# Altium schematic sheet signal_conditioning.SchDoc
size A4
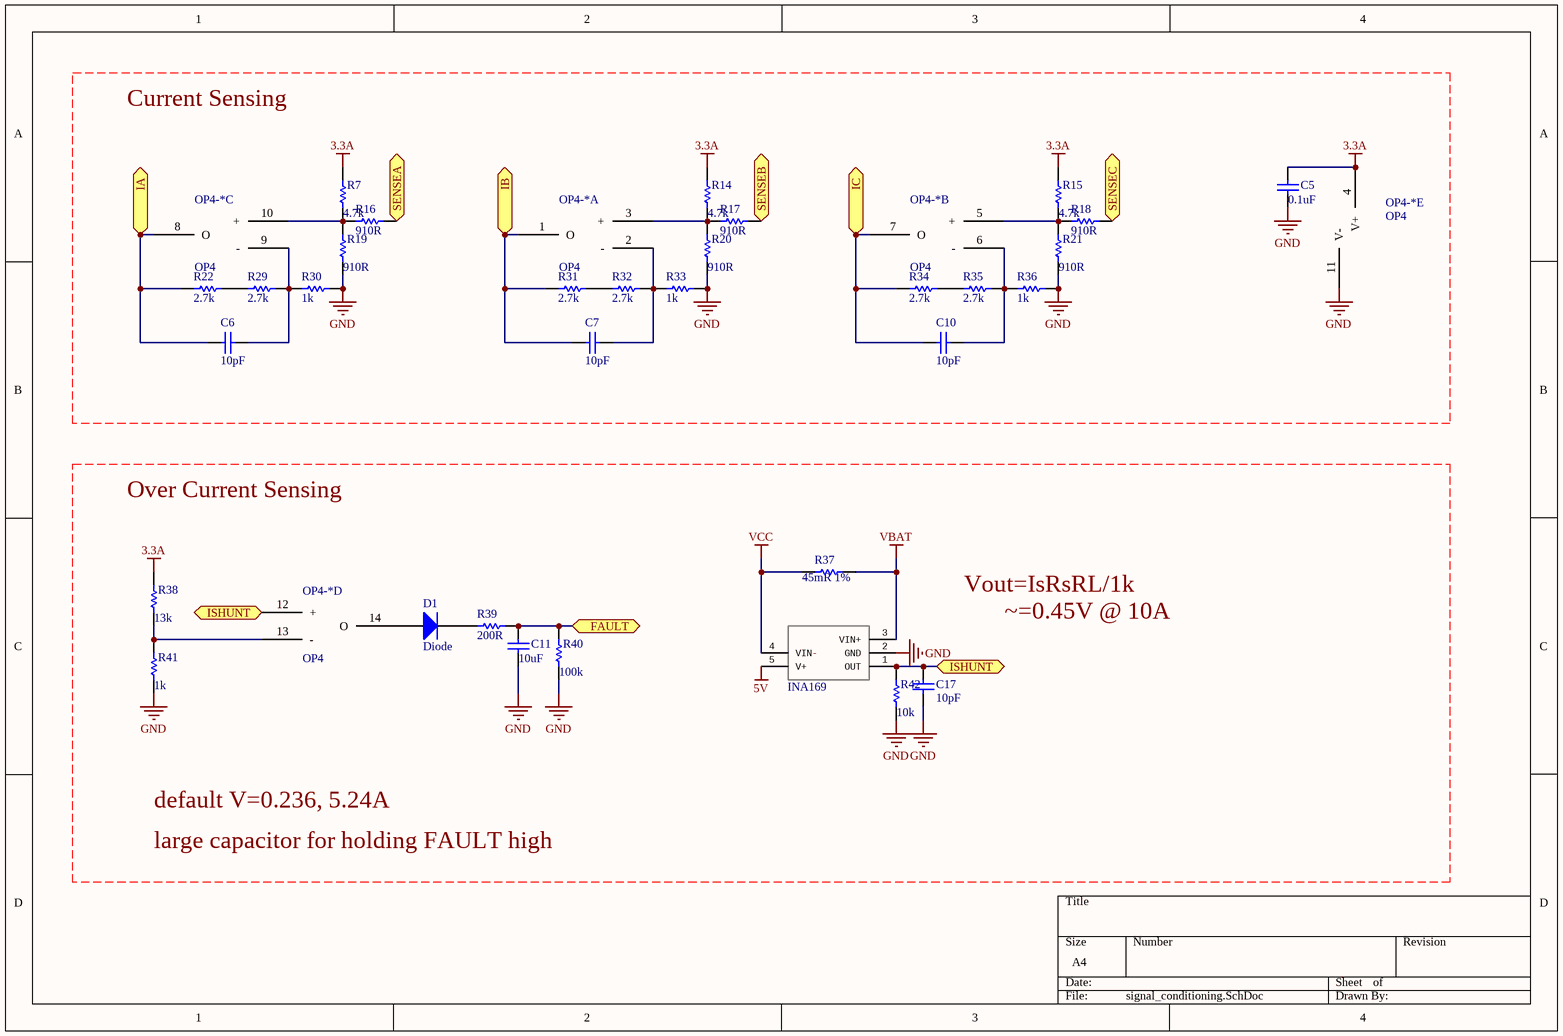
[diagram p0: signal_conditioning.SchDoc]

## Parts
C5  0.1uF  [0603]
C6  10pF  [0603]
C7  10pF  [0603]
C10  10pF  [0603]
C11  10uF  [0805]
C17  10pF  [0603]
D1  Diode  [0805]
OP4-*  OP4  [SOP14]  (parts A,B,C,D,E of 5)
R7  4.7k  [0603]
R14  4.7k  [0603]
R15  4.7k  [0603]
R16  910R  [0603]
R17  910R  [0603]
R18  910R  [0603]
R19  910R  [0603]
R20  910R  [0603]
R21  910R  [0603]
R22  2.7k  [0603]
R29  2.7k  [0603]
R30  1k  [0603]
R31  2.7k  [0603]
R32  2.7k  [0603]
R33  1k  [0603]
R34  2.7k  [0603]
R35  2.7k  [0603]
R36  1k  [0603]
R37  45mR 1%  [2512]
R38  13k  [0603]
R39  200R  [0603]
R40  100k  [0603]
R41  1k  [0603]
R42  10k  [0603]
U$1  INA169  [SOT23-5]

## Ports
FAULT, IA, IB, IC, ISHUNT, SENSEA, SENSEB, SENSEC

## Nets
3.3A: C5.1 OP4-*.4(V+) R7.2 R14.2 R15.2 R38.2
5V: U$1.5(V+)
GND: C5.2 C11.2 C17.1 OP4-*.11(V-) R19.1 R20.1 R21.1 R30.1 R33.1 R36.1 R40.1 R41.1 R42.1 U$1.2(GND)
VBAT: R37.2 U$1.3(VIN+)
VCC: R37.1 U$1.4(VIN-)
FAULT: C11.1 R39.1 R40.2 ; port FAULT
IA: C6.1 OP4-*.8(O) R22.2 ; port IA
IB: C7.1 OP4-*.1(O) R31.2 ; port IB
IC: C10.1 OP4-*.7(O) R34.2 ; port IC
ISHUNT: C17.2 OP4-*.12(+) R42.2 U$1.1(OUT) ; port ISHUNT
SENSEA: R16.1 ; port SENSEA
SENSEB: R17.1 ; port SENSEB
SENSEC: R18.1 ; port SENSEC
NetC6_2: C6.2 OP4-*.9(-) R29.1 R30.2
NetC7_2: C7.2 OP4-*.2(-) R32.1 R33.2
NetC10_2: C10.2 OP4-*.6(-) R35.1 R36.2
NetD1_1: D1.1(A) OP4-*.14(O)
NetD1_2: D1.2(K) R39.2
NetOP4-*_3: OP4-*.3(+) R14.1 R17.2 R20.2
NetOP4-*_5: OP4-*.5(+) R15.1 R18.2 R21.2
NetOP4-*_10: OP4-*.10(+) R7.1 R16.2 R19.2
NetOP4-*_13: OP4-*.13(-) R38.1 R41.2
NetR22_1: R22.1 R29.2
NetR31_1: R31.1 R32.2
NetR34_1: R34.1 R35.2

## Notes on the sheet
- Current Sensing
- Over Current Sensing
- Vout=IsRsRL/1k
- ~=0.45V @ 10A
- default V=0.236, 5.24A
- large capacitor for holding FAULT high

## Library data of the parts
C5 = Cap: Capacitor; Published: 8-Jun-2000; LatestRevisionDate: 17-Jul-2002; LatestRevisionNote: Re-released for DXP Platform.; PackageReference: RAD-0.3; Publisher: Altium Limited; PackageDescription: Radial Cap, Thru-Hole; 2 Leads; 0.3 in Pin Spacing; Value: 0.1uf
C6 C7 C10 C11 C17 = Cap: Capacitor; Value: 0.1uf; Published: 8-Jun-2000; LatestRevisionDate: 17-Jul-2002; LatestRevisionNote: Re-released for DXP Platform.; PackageReference: RAD-0.3; Publisher: Altium Limited; PackageDescription: Radial Cap, Thru-Hole; 2 Leads; 0.3 in Pin Spacing
D1 = Diode: Default Diode; Published: 8-Jun-2000; LatestRevisionDate: 17-Jul-2002; LatestRevisionNote: Re-released for DXP Platform.; PackageVersion: Sep-1996; PackageReference: SMC; Publisher: Altium Limited; PackageDescription: DO-214-AB/SMC; 2 C-Bend Leads; Body 7.9 x 5.9 mm, inc. leads (LxW); Code_JEDEC: DO-214-AB
R7 R14-R22 R29-R41 = Res1: Resistor; Value: 10K; Published: 8-Jun-2000; LatestRevisionDate: 17-Jul-2002; LatestRevisionNote: Re-released for DXP Platform.; PackageReference: AXIAL-0.3; Publisher: Altium Limited; PackageDescription: Axial Device, Thru-Hole; 2 Leads; 0.3 in Pin Spacing
R42 = Res1: Resistor; Published: 8-Jun-2000; LatestRevisionDate: 17-Jul-2002; LatestRevisionNote: Re-released for DXP Platform.; PackageReference: AXIAL-0.3; Publisher: Altium Limited; PackageDescription: Axial Device, Thru-Hole; 2 Leads; 0.3 in Pin Spacing; Value: 10K